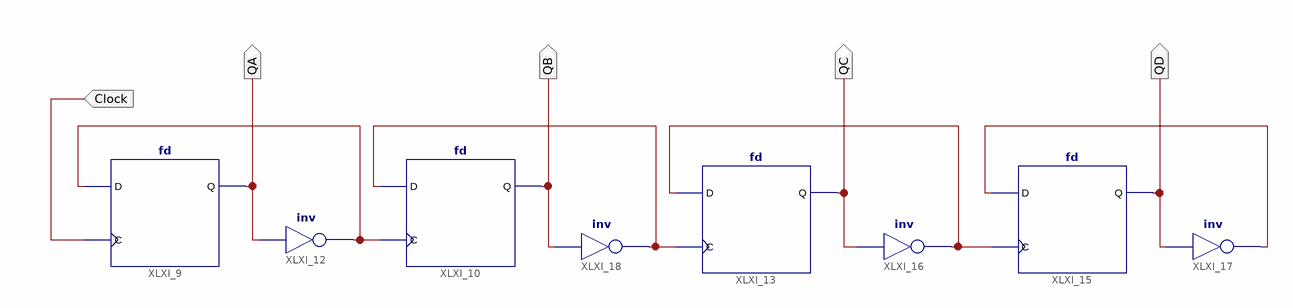
[diagram p0: schematic sheet 1]
// Xilinx ISE schematic counter.sch (spartan6) as structural Verilog: 8 symbols, 5 ports
module counter (
  input  Clock,
  output QA,
  output QB,
  output QC,
  output QD
);

  wire XLXN_10, XLXN_13, XLXN_25, XLXN_35;

  fd XLXI_9 (.C(Clock), .D(XLXN_35), .Q(QA));
  not XLXI_12 (XLXN_35, QA);
  not XLXI_18 (XLXN_10, QB);
  fd XLXI_10 (.C(XLXN_35), .D(XLXN_10), .Q(QB));
  fd XLXI_13 (.C(XLXN_10), .D(XLXN_13), .Q(QC));
  not XLXI_16 (XLXN_13, QC);
  fd XLXI_15 (.C(XLXN_13), .D(XLXN_25), .Q(QD));
  not XLXI_17 (XLXN_25, QD);
endmodule
